# EAGLE schematic BatchD (EAGLE 6.4)
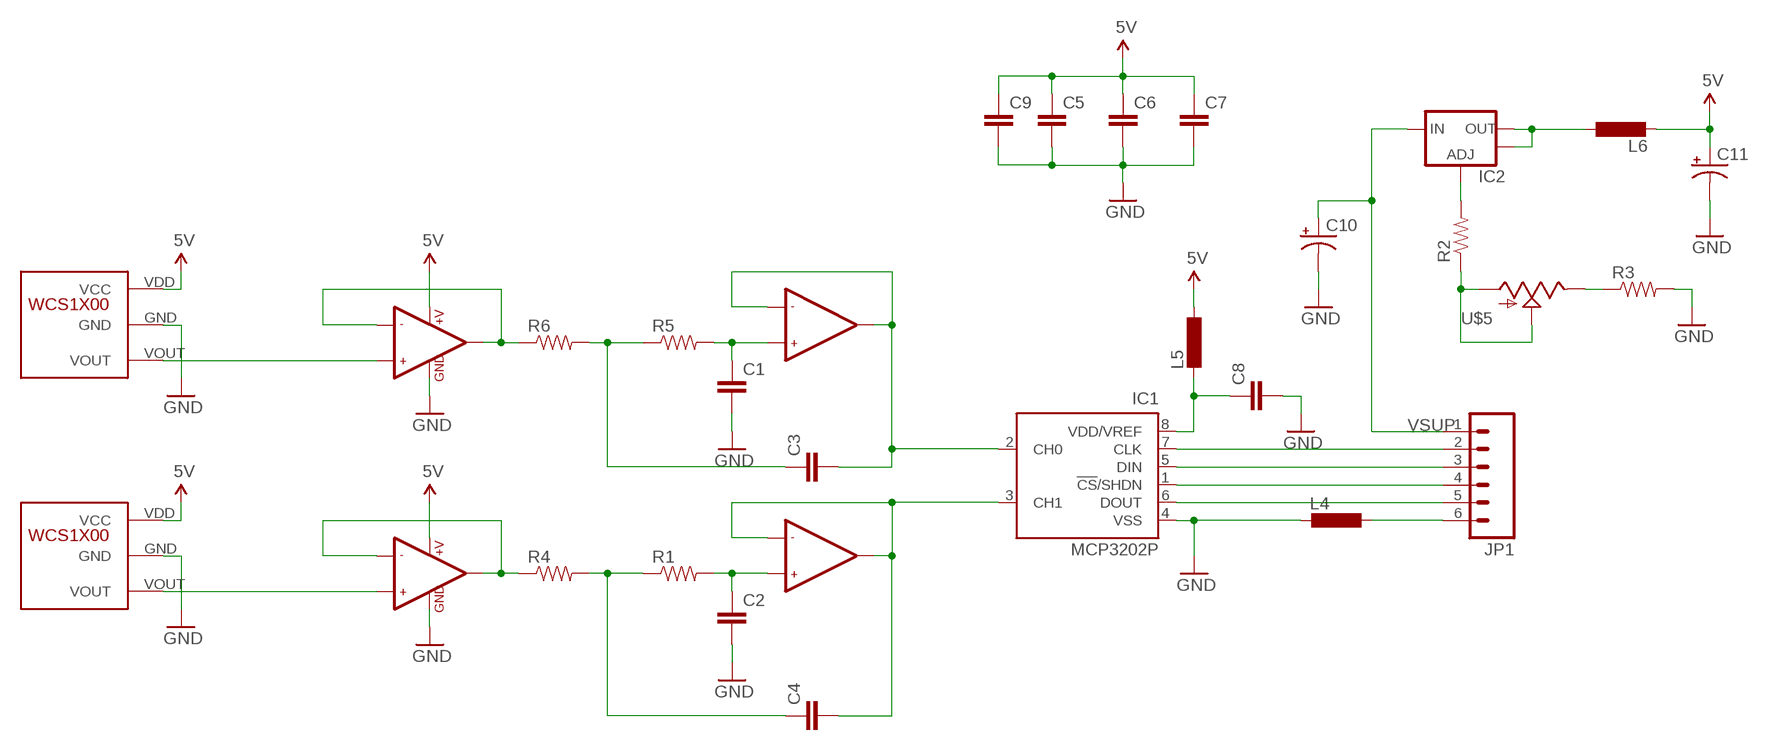
[diagram p0: schematic, sheet 1]

## Parts
C1  CAP1206  [1206]
C2  CAP1206  [1206]
C3  CAP1206  [1206]
C4  CAP1206  [1206]
C5  CAP1206  [1206]
C6  CAP1206  [1206]
C7  CAP1206  [1206]
C8  CAP1206  [1206]
C9  CAP1206  [1206]
C10  CAP_POLPTH4  [CPOL-RADIAL-1000UF-25V]
C11  CAP_POLPTH1  [CPOL-RADIAL-100UF-25V]
IC1  MCP3202P  [DIL8]
IC2  V_REG_LM1117SOT223  [SOT223]
JP1  M06LONGPADS  [1X06_LONGPADS]
L4  L-EU0204V  [0204V]
L5  L-EU0204V  [0204V]
L6  L-EU0204V  [0204V]
R1  RESISTOR1206  [1206]
R2  RESISTOR1206  [1206]
R3  RESISTOR1206  [1206]
R4  RESISTOR1206  [1206]
R5  RESISTOR1206  [1206]
R6  RESISTOR1206  [1206]
U$1  LMV358  [SO08]
U$2  LMV358  [SO08]
U$3  WCS1X00  [WCS1X00]
U$4  WCS1X00  [WCS1X00]
U$5  POTTRIM  [TRIM_POT]

## Nets
5V: C5.1 C6.1 C7.1 C9.1 C11.1(+) L5.1 L6.2 U$1.8(+V) U$2.8(+V) U$3.VDD(VCC) U$4.VDD(VCC)
GND: C1.2 C2.2 C5.2 C6.2 C7.2 C8.2 C9.2 C10.2(-) C11.2(-) IC1.4(VSS) L4.2 R3.2 U$1.4(GND) U$2.4(GND) U$3.GND U$4.GND
N$1: R6.1 U$1.1(OUT1) U$1.2(-IN1)
N$2: R4.1 U$2.1(OUT1) U$2.2(-IN1)
N$3: C3.1 R5.1 R6.2
N$4: C1.1 R5.2 U$1.5(+IN2)
N$5: C3.2 IC1.2(CH0) U$1.6(-IN2) U$1.7(OUT2)
N$6: U$1.3(+IN1) U$3.VOUT
N$7: C4.2 IC1.3(CH1) U$2.6(-IN2) U$2.7(OUT2)
N$8: C2.1 R1.2 U$2.5(+IN2)
N$9: C4.1 R1.1 R4.2
N$10: U$2.3(+IN1) U$4.VOUT
N$11: IC2.1(ADJ) R2.2
N$12: R2.1 U$5.1(S) U$5.3(A)
N$13: IC1.7(CLK) JP1.2
N$14: IC1.5(DIN) JP1.3
N$15: IC1.1(!CS!/SHDN) JP1.4
N$16: IC1.6(DOUT) JP1.5
N$17: IC2.2(OUT) IC2.4(OUT) L6.1
N$18: R3.1 U$5.2(E)
N$19: JP1.6 L4.1
N$20: C8.1 IC1.8(VDD/VREF) L5.2
VSUP: C10.1(+) IC2.3(IN) JP1.1

## Library data of the parts
C1-C9 = SparkFun-Capacitors:CAP: Capacitor Standard 0603 ceramic capacitor, and 0.1" leaded capacitor.
C10 C11 = SparkFun-Capacitors:CAP_POL: Capacitor Polarized These are standard SMD and PTH capacitors. Normally 10uF, 47uF, and 100uF in electrolytic and tantalum varieties. Always verify the external diameter of the through hole cap, it varies with capacity, voltage, and manufacturer. The EIA devices should be standard.
IC1 = microchip:MCP3202: 2.7V Dual Channel 12-Bit A/D Converter with SPI Serial Interface Source: http://ww1.microchip.com/downloads/en/DeviceDoc/21034D.pdf; MF: MICROCHIP; MPN: MCP3202-CI/P; OC_FARNELL: 1196794; OC_NEWARK: 72K7287
IC2 = SparkFun-PowerIC:V_REG_LM1117: Voltage Regulator LM1117 Standard adjustable voltage regulator but in SMD form. Spark Fun Electronics SKU : COM-00595
JP1 = SparkFun-Connectors:M06: Header 6 Standard 6-pin 0.1" header. Use with straight break away headers (SKU : PRT-00116), right angle break away headers (PRT-00553), swiss pins (PRT-00743), machine pins (PRT-00117), and female headers (PRT-00115). Molex polarized connector foot print use with SKU : PRT-08094 with associated crimp pins and housings. NOTES ON THE VARIANTS LOCK and LOCK_LONGPADS... This footprint was designed to help hold the alignment of a through-hole component (i.e. 6-pin header) while soldering it into place. You may notice that each hole has been shifted either up or down by 0.005 of an inch from it's more standard position (which is a perfectly straight line). This slight alteration caused the pins (the squares in the middle) to touch the edges of the holes. Because they are alternating, it causes a "brace" to hold the component in place. 0.005 has proven to be the perfect amount of "off-center" position when using our standard breakaway headers. Although looks a little odd when you look at the bare footprint, once you have a header in there, the alteration is very hard to notice. Also, if you push a header all the way into place, it is covered up entirely on the bottom side. This idea of altering the position of holes to aid alignment will be further integrated into the Sparkfun Library for other footprints. It can help hold any component with 3 or more connection pins.
L4-L6 = rcl:L-EU: INDUCTOR, European symbol
R1-R6 = SparkFun-Passives:RESISTOR: Resistor Basic schematic elements and footprints for 0603, 1206, and PTH resistors.
U$1 U$2 = SparkFun-AnalogIC:LMV358: Jellybean rail-to-rail output op-amp
U$3 U$4 = IC:WCS1X00
U$5 = SparkFun-Electromechanical:POT